# Altium schematic sheet Sheet_1_2021-05-29.schdoc
size 229 x 88 mm
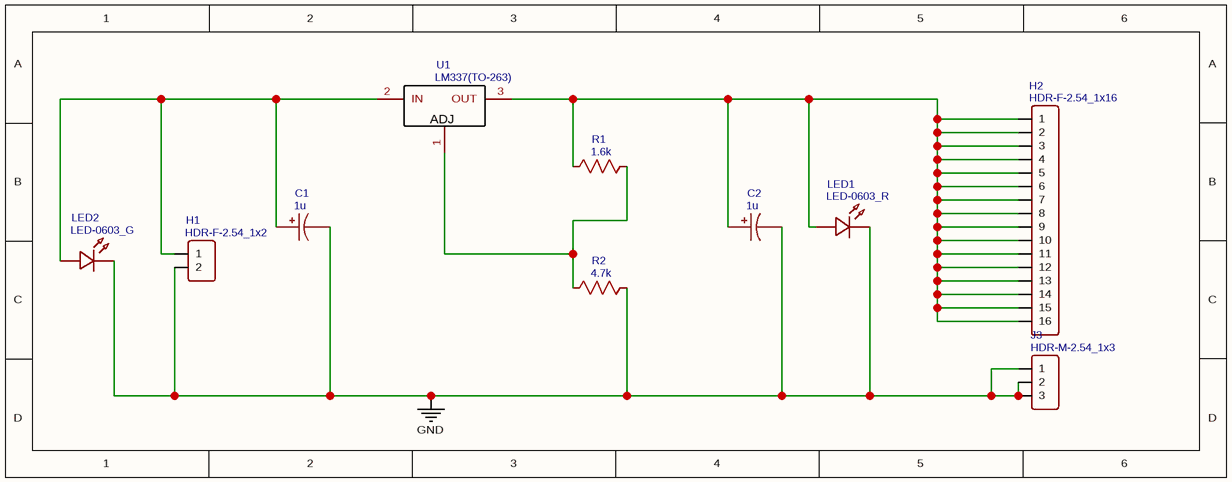
[diagram p0: Sheet_1_2021-05-29.schdoc]

## Parts
C1  1u  [CASE-A_3216]
C2  1u  [CASE-A_3216]
H1  HDR-F-2.54_1x2  [HDR-F-2.54_1X2]
H2  HDR-F-2.54_1x16  [HDR-F-2.54_1X16]
J3  HDR-M-2.54_1x3  [HDR-M-2.54_1X3]
LED1  LED-0603_R  [LED0603_RED]
LED2  LED-0603_G  [LED0603_GREEN]
R1  1.6k  [R0603]
R2  4.7k  [R0603]
U1  LM337(TO-263)  [TO-263-2_L10.1-W9.1-P5.08-LS15.2-BR]

## Nets
GND: C1.2 C2.2 H1.2 J3.1 J3.2 J3.3 LED1.2 LED2.2 R2.2
NetC1_1: C1.1 H1.1 LED2.1 U1.2(IN)
NetC2_1: C2.1 H2.1 H2.2 H2.3 H2.4 H2.5 H2.6 H2.7 H2.8 H2.9 H2.10 H2.11 H2.12 H2.13 H2.14 H2.15 H2.16 LED1.1 R1.1 U1.3(OUT)
NetR1_2: R1.2 R2.1 U1.1(ADJ)

## Library data of the parts
C1 C2 = 1u: nameAlias: Value(F); Contributor: LCEDA_Lib; spicePre: C; spiceSymbolName: C_Tan_SMD_A_US
H1 = HDR-F-2.54_1x2: Contributor: LCEDA_Lib; BOM_Supplier Part: C49661; BOM_Supplier: LCSC; spicePre: H; spiceSymbolName: HDR-F-2.54_1x2
H2 = HDR-F-2.54_1x16: Contributor: LCEDA_Lib; BOM_Supplier Part: C66987; BOM_Supplier: LCSC; spicePre: H; spiceSymbolName: HDR-F-2.54_1x16
J3 = HDR-M-2.54_1x3: Contributor: LCEDA_Lib; BOM_Supplier Part: C180248; BOM_Supplier: LCSC; spicePre: J; spiceSymbolName: HDR-M-2.54_1x3
LED1 = LED-0603_R: BOM_Manufacturer: EVERLIGHT(台湾亿光); BOM_Manufacturer Part: 19-217/R6C-AL1M2VY/3T; Contributor: LCEDA_01; BOM_Supplier Part: C72044; BOM_Supplier: LCSC; spicePre: L; spiceSymbolName: LED-0603_R
LED2 = LED-0603_G: BOM_Manufacturer: EVERLIGHT(台湾亿光); BOM_Manufacturer Part: 19-217/GHC-YR1S2/3T; Contributor: LCEDA_Lib; BOM_Supplier Part: C72043; BOM_Supplier: LCSC; spicePre: L; spiceSymbolName: LED-0603_G
R1 = 1.6k: nameAlias: Value(Ω); Contributor: LCEDA_Lib; spicePre: R; spiceSymbolName: R_0603_US
R2 = 4.7k: nameAlias: Value(Ω); Contributor: LCEDA_Lib; spicePre: R; spiceSymbolName: R_0603_US
U1 = LM337(TO-263): BOM_Manufacturer: ON; BOM_Manufacturer Part: LM337D2TG; Contributor: LCEDA_Lib; BOM_Supplier: LCSC; BOM_Supplier Part: C146782; spicePre: U; spiceSymbolName: LM337(TO-263)